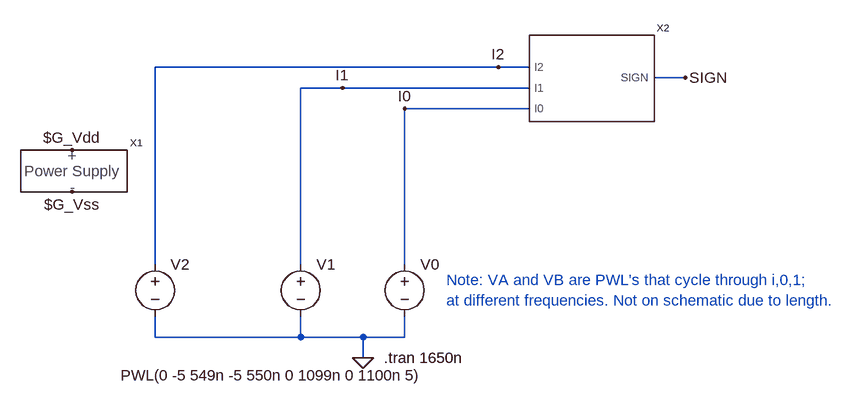
[diagram p0: schematic tsign-test.asc]
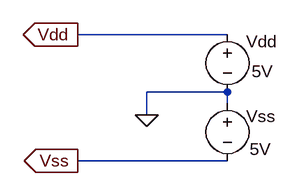
[diagram p1: sub-circuit tpower.asc]
tsign-test.asc, the LTspice schematic file:
Version 4
SHEET 1 6348 708
WIRE 192 -16 -336 -16
WIRE 240 -16 192 -16
WIRE 480 0 432 0
WIRE -48 16 -112 16
WIRE 240 16 -48 16
WIRE 240 48 48 48
WIRE -336 288 -336 -16
WIRE -112 288 -112 16
WIRE 48 288 48 48
WIRE -336 400 -336 368
WIRE -112 400 -112 368
WIRE -112 400 -336 400
WIRE -16 400 -112 400
WIRE 48 400 48 368
WIRE 48 400 -16 400
WIRE -16 432 -16 400
FLAG -464 176 $G_Vss
FLAG -464 112 $G_Vdd
FLAG -16 432 0
FLAG -48 16 I1
FLAG 48 48 I0
FLAG 192 -16 I2
FLAG 480 0 SIGN
SYMBOL tpower -464 144 R0
SYMATTR InstName X1
SYMBOL voltage -112 272 R0
WINDOW 3 -283 226 Invisible 0
WINDOW 123 0 0 Left 0
WINDOW 39 0 0 Left 0
SYMATTR Value PWL(0 -5 50E-9 -5 60E-9 -5 110E-9 -5 120E-9 -5 170E-9 -5 180E-9 0 230E-9 0 240E-9 0 290E-9 0 300E-9 0 350E-9 0 360E-9 5 410E-9 5 420E-9 5 470E-9 5 480E-9 5 530E-9 5 550E-9 -5 600E-9 -5 610E-9 -5 660E-9 -5 670E-9 -5 720E-9 -5 730E-9 0 780E-9 0 790E-9 0 840E-9 0 850E-9 0 900E-9 0 910E-9 5 960E-9 5 970E-9 5 1020E-9 5 1030E-9 5 1080E-9 5 1100E-9 -5 1150E-9 -5 1160E-9 -5 1210E-9 -5 1220E-9 -5 1270E-9 -5 1280E-9 0 1330E-9 0 1340E-9 0 1390E-9 0 1400E-9 0 1450E-9 0 1460E-9 5 1510E-9 5 1520E-9 5 1570E-9 5 1580E-9 5 1630E-9 5)
SYMATTR InstName V1
SYMBOL voltage 48 272 R0
WINDOW 3 -440 260 Invisible 0
WINDOW 123 0 0 Left 0
WINDOW 39 0 0 Left 0
SYMATTR Value PWL(0 -5 50E-9 -5 60E-9 0 110E-9 0 120E-9 5 170E-9 5 180E-9 -5 230E-9 -5 240E-9 0 290E-9 0 300E-9 5 350E-9 5 360E-9 -5 410E-9 -5 420E-9 0 470E-9 0 480E-9 5 530E-9 5 550E-9 -5 600E-9 -5 610E-9 0 660E-9 0 670E-9 5 720E-9 5 730E-9 -5 780E-9 -5 790E-9 0 840E-9 0 850E-9 5 900E-9 5 910E-9 -5 960E-9 -5 970E-9 0 1020E-9 0 1030E-9 5 1080E-9 5 1100E-9 -5 1150E-9 -5 1160E-9 0 1210E-9 0 1220E-9 5 1270E-9 5 1280E-9 -5 1330E-9 -5 1340E-9 0 1390E-9 0 1400E-9 5 1450E-9 5 1460E-9 -5 1510E-9 -5 1520E-9 0 1570E-9 0 1580E-9 5 1630E-9 5)
SYMATTR InstName V0
SYMBOL voltage -336 272 R0
WINDOW 3 -53 187 Left 0
SYMATTR Value PWL(0 -5 549n -5 550n 0 1099n 0 1100n 5)
SYMATTR InstName V2
SYMBOL tsign 336 -48 R0
SYMATTR InstName X2
TEXT 16 432 Left 0 !.tran 1650n
TEXT 112 312 Left 0 ;Note: VA and VB are PWL's that cycle through i,0,1;\nat different frequencies. Not on schematic due to length.

tpower.asc, the sub-circuit schematic file:
Version 4
SHEET 1 880 680
WIRE -112 32 -320 32
WIRE -112 112 -224 112
WIRE -112 128 -112 112
WIRE -224 144 -224 112
WIRE -112 208 -320 208
FLAG -224 144 0
FLAG -320 32 Vdd
IOPIN -320 32 Out
FLAG -320 208 Vss
IOPIN -320 208 Out
SYMBOL voltage -112 16 R0
WINDOW 0 26 26 Left 0
WINDOW 3 34 68 Left 0
SYMATTR InstName Vdd
SYMATTR Value 5V
SYMBOL voltage -112 112 R0
WINDOW 0 26 34 Left 0
WINDOW 3 31 80 Left 0
SYMATTR InstName Vss
SYMATTR Value 5V

The netlist it stands for:
* tsign-test.asc
XX1 $G_Vdd $G_Vss tpower
V1 I1 0 PWL(0 -5 50E-9 -5 60E-9 -5 110E-9 -5 120E-9 -5 170E-9 -5 180E-9 0 230E-9 0 240E-9 0 290E-9 0 300E-9 0 350E-9 0 360E-9 5 410E-9 5 420E-9 5 470E-9 5 480E-9 5 530E-9 5 550E-9 -5 600E-9 -5 610E-9 -5 660E-9 -5 670E-9 -5 720E-9 -5 730E-9 0 780E-9 0 790E-9 0 840E-9 0 850E-9 0 900E-9 0 910E-9 5 960E-9 5 970E-9 5 1020E-9 5 1030E-9 5 1080E-9 5 1100E-9 -5 1150E-9 -5 1160E-9 -5 1210E-9 -5 1220E-9 -5 1270E-9 -5 1280E-9 0 1330E-9 0 1340E-9 0 1390E-9 0 1400E-9 0 1450E-9 0 1460E-9 5 1510E-9 5 1520E-9 5 1570E-9 5 1580E-9 5 1630E-9 5)
V0 I0 0 PWL(0 -5 50E-9 -5 60E-9 0 110E-9 0 120E-9 5 170E-9 5 180E-9 -5 230E-9 -5 240E-9 0 290E-9 0 300E-9 5 350E-9 5 360E-9 -5 410E-9 -5 420E-9 0 470E-9 0 480E-9 5 530E-9 5 550E-9 -5 600E-9 -5 610E-9 0 660E-9 0 670E-9 5 720E-9 5 730E-9 -5 780E-9 -5 790E-9 0 840E-9 0 850E-9 5 900E-9 5 910E-9 -5 960E-9 -5 970E-9 0 1020E-9 0 1030E-9 5 1080E-9 5 1100E-9 -5 1150E-9 -5 1160E-9 0 1210E-9 0 1220E-9 5 1270E-9 5 1280E-9 -5 1330E-9 -5 1340E-9 0 1390E-9 0 1400E-9 5 1450E-9 5 1460E-9 -5 1510E-9 -5 1520E-9 0 1570E-9 0 1580E-9 5 1630E-9 5)
V2 I2 0 PWL(0 -5 549n -5 550n 0 1099n 0 1100n 5)
XX2 I0 I1 I2 SIGN tsign  ; pins I0 I1 I2 SIGN

* block symbol definitions
.subckt tpower Vdd Vss
Vdd Vdd 0 5V
Vss 0 Vss 5V
.ends tpower

.tran 1650n
* Note: VA and VB are PWL's that cycle through i,0,1;
* at different frequencies. Not on schematic due to length.
.backanno
.end